# EAGLE design atmega328 (EAGLE 9.6.2)
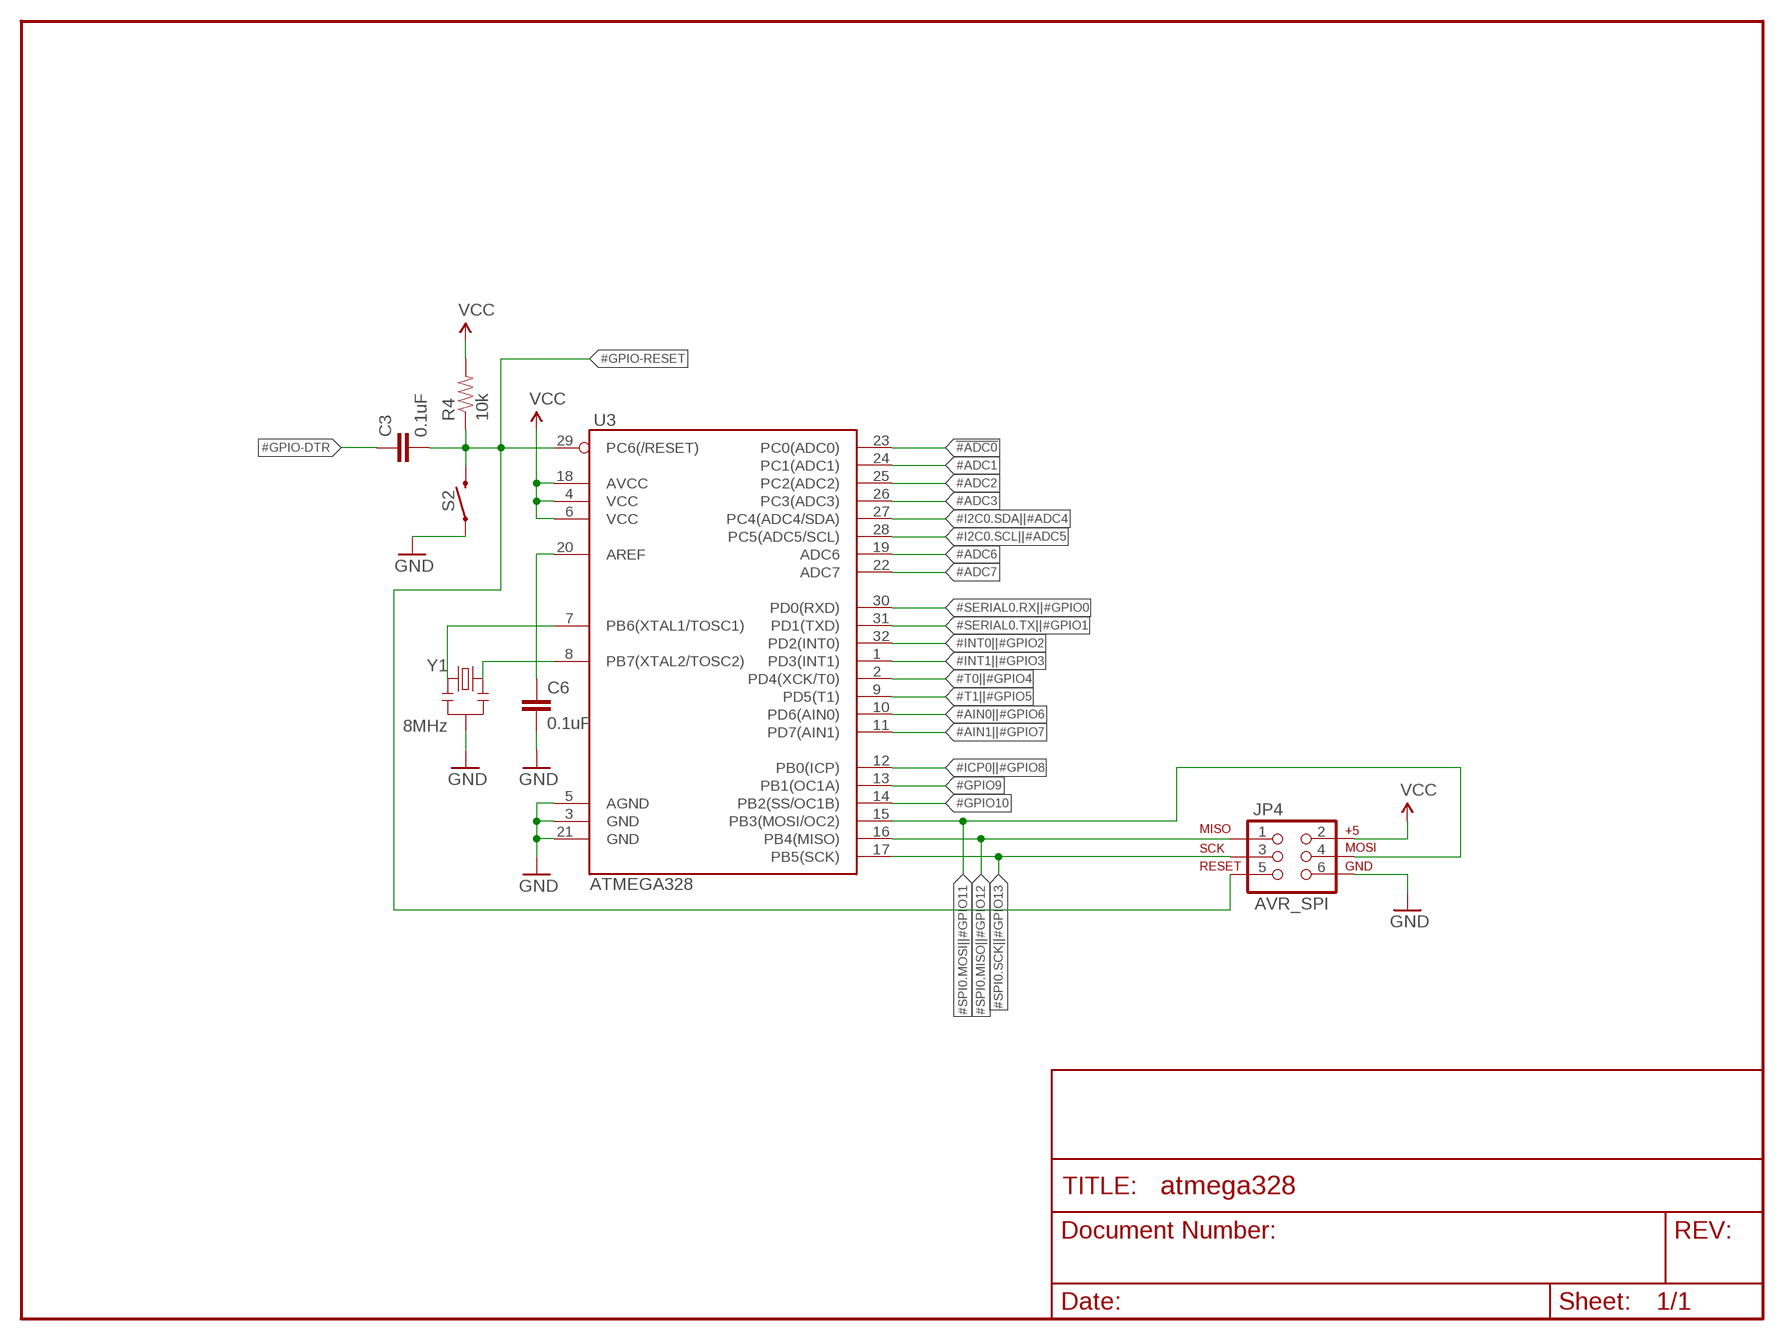
[diagram p0: schematic, sheet 1]

## Parts
C3  0.1uF  0.1UF-0603-25V-5%  [0603]
C6  0.1uF  0.1UF-0603-25V-5%  [0603]
JP4  AVR_SPI  AVR_SPI_PRG_6PTH  [2X3]
R4  10k  10KOHM-0603-1/10W-1%  [0603]
S2  MOMENTARY-SWITCH-SPST-SMD-6.2MM-TALL  [TACTILE_SWITCH_SMD_6.2MM_TALL]
U3  ATMEGA328  ATMEGA168  [TQFP32-08]
Y1  8MHz  RESONATORSMD  [RESONATOR-SMD]

## Nets
!#ADC0: U3.23(PC0(ADC0))
#ADC1: U3.24(PC1(ADC1))
#ADC2: U3.25(PC2(ADC2))
#ADC3: U3.26(PC3(ADC3))
#ADC6: U3.19(ADC6)
#ADC7: U3.22(ADC7)
#AIN0||#GPIO6: U3.10(PD6(AIN0))
#AIN1||#GPIO7: U3.11(PD7(AIN1))
#GPIO9: U3.13(PB1(OC1A))
#GPIO10: U3.14(PB2(SS/OC1B))
#GPIO-DTR: C3.1
#GPIO-RESET: C3.2 JP4.5 R4.1 S2.B2 U3.29(PC6(/RESET))
#I2C0.SCL||#ADC5: U3.28(PC5(ADC5/SCL))
#I2C0.SDA||#ADC4: U3.27(PC4(ADC4/SDA))
#ICP0||#GPIO8: U3.12(PB0(ICP))
#INT0||#GPIO2: U3.32(PD2(INT0))
#INT1||#GPIO3: U3.1(PD3(INT1))
#SERIAL0.RX||#GPIO0: U3.30(PD0(RXD))
#SERIAL0.TX||#GPIO1: U3.31(PD1(TXD))
#SPI0.MISO||#GPIO12: JP4.1 U3.16(PB4(MISO))
#SPI0.MOSI||#GPIO11: JP4.4 U3.15(PB3(MOSI/OC2))
#SPI0.SCK||#GPIO13: JP4.3 U3.17(PB5(SCK))
#T0||#GPIO4: U3.2(PD4(XCK/T0))
#T1||#GPIO5: U3.9(PD5(T1))
AREF: C6.1 U3.20(AREF)
GND: C6.2 JP4.6 S2.A2 U3.3(GND) U3.5(AGND) U3.21(GND) Y1.2
N$10: U3.7(PB6(XTAL1/TOSC1)) Y1.3
N$12: U3.8(PB7(XTAL2/TOSC2)) Y1.1
VCC [VCC]: JP4.2 R4.2 U3.4(VCC) U3.6(VCC) U3.18(AVCC)

## Library data of the parts
C3 C6 = SparkFun-Capacitors:0.1UF: 0.1µF ceramic capacitors A capacitor is a passive two-terminal electrical component used to store electrical energy temporarily in an electric field.; PROD_ID: CAP-08604
JP4 = SparkFun:AVR_SPI_PRG_6: AVR ISP 6 Pin This is the reduced ISP connector for AVR programming. Common on Arduino. This footprint will take up less PCB space and can be used with a 10-pin to 6-pin adapter such as SKU: BOB-08508
R4 = SparkFun-Resistors:10KOHM: 10kΩ resistor A resistor is a passive two-terminal electrical component that implements electrical resistance as a circuit element. Resistors act to reduce current flow, and, at the same time, act to lower voltage levels within circuits. - Wikipedia; PROD_ID: RES-00824
S2 = SparkFun-Switches:MOMENTARY-SWITCH-SPST: Momentary Switch (Pushbutton) - SPST Normally-open (NO) SPST momentary switches (buttons, pushbuttons). Variants PTH-12MM - 12mm square, through-hole Momentary Pushbutton Switch - 12mm Square <https://www.sparkfun.com/products/9190> (COM-09190) PTH-6.0MM, PTH-6.0MM-KIT - 6.0mm square, through-hole Mini Pushbutton Switch <https://www.sparkfun.com/products/97> (COM-00097) KIT package intended for soldering kit's - only one side of pads' copper is exposed. PTH-RIGHT-ANGLE-KIT - Right-angle, through-hole Right Angle Tactile Button <https://www.sparkfun.com/products/10791> - Used on SparkFun BigTime Watch Kit <https://www.sparkfun.com/products/11734> SMD-12MM - 12mm square, surface-mount Tactile Button - SMD (12mm) <https://www.sparkfun.com/products/12993> (COM-12993) Used on SparkFun PicoBoard <https://www.sparkfun.com/products/11888> SMD-4.5MM - 4.5mm Square Trackball Switch Used on SparkFun Blackberry Trackballer Breakout <https://www.sparkfun.com/products/13169> SMD-4.6MMX2.8MM - 4.60mm x 2.80mm, surface mount Used on SparkFun SAMD21 Mini Breakout <https://www.sparkfun.com/products/13664> SMD-5.2MM, SMD-5.2-REDUNDANT - 5.2mm square, surface-mount Mini Pushbutton Switch - SMD <https://www.sparkfun.com/products/8720> (COM-08720) Used on Arduino Pro Mini <https://www.sparkfun.com/products/11114> REDUNDANT package connects both switch circuits together SMD-6.0X3.5MM - 6.0 x 3.5mm, surface mount Momentary Reset Switch SMD <https://www.sparkfun.com/products/8229> (COM-08229) SMD-6.2MM-TALL - 6.2mm square, surface mount Tactile Button - SMD (6mm) <https://www.sparkfun.com/products/12992> Used on SparkFun Digital Sandbox <https://www.sparkfun.com/products/12651> SMD-RIGHT-ANGLE - Right-angle, surface mount Used on SparkFun Block for Intel® Edison - Arduino <https://www.sparkfun.com/products/13036>; PROD_ID: SWCH-11966; SF_SKU: COM-12992
U3 = SparkFun:ATMEGA168
Y1 = SparkFun:RESONATOR: Resonator Small SMD resonator. This is the itty bitty 10/20MHz resonators with built in caps. CSTCE10M0G55 and CSTCE20M0V53. Footprint has been reviewed closely but hasn't been tested yet.

## Net classes
1 VCC: width 0.381 mm

## Board
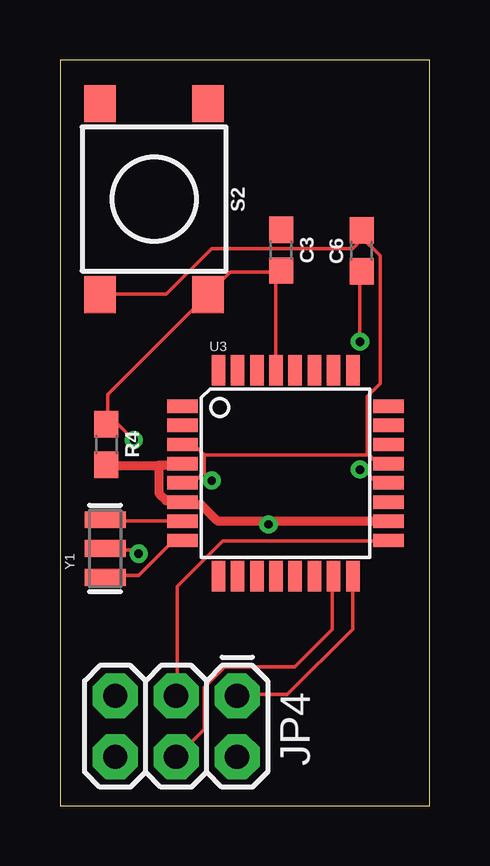
[diagram p1: board, top side]
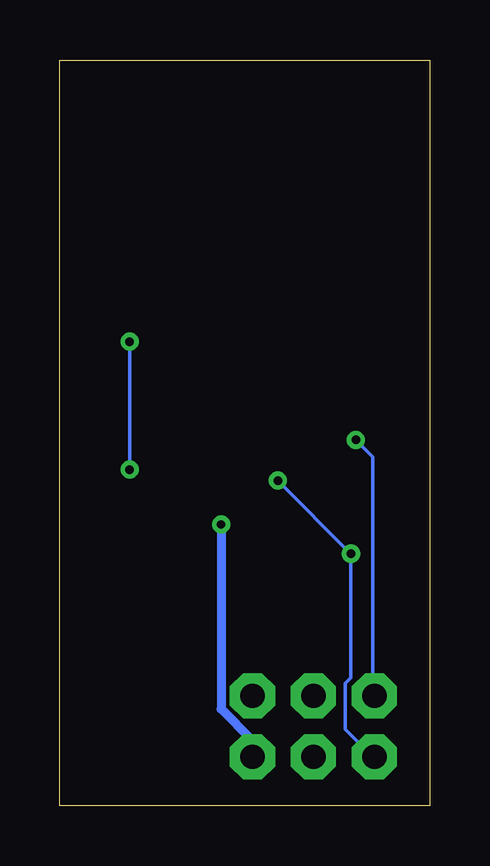
[diagram p2: board, bottom side, seen from below]

Size 15.4 x 31.1 mm. Coordinates in mm from the lower left corner, seen from the top.
Outline: 0,0 15.4,0 15.4,31.1 0,31.1 0,0
Copper layers (1*16): Top 0.035mm / dielectric 1.5mm / Bottom 0.035mm
Design rules "default": minimum track width 6mil, minimum drill 0.35mm, track to track 6mil, track to pad 6mil, pad to pad 6mil, via to via 6mil, smd to smd 6mil, copper to edge 40mil, drill to drill 6mil, minimum pad ring 10mil, minimum via ring 8mil, stop-mask expansion 4mil, vias tented up to drill 0mil, thermal gap 10mil

### Footprints (pad centres in the part's own frame; a part is rotated, then mirrored left to right if it is on the bottom)
0603 = smd 1.1 x 1: 1 -0.85,0; 2 0.85,0
2X3 = drill 1.016 pad 1.88 octagon: 1 0,0; 2 0,2.54; 3 2.54,0; 4 2.54,2.54; 5 5.08,0; 6 5.08,2.54
TACTILE_SWITCH_SMD_6.2MM_TALL = smd 1.55 x 1.3: A1 -3.975,-2.25; A2 3.975,-2.25; B1 -3.975,2.25; B2 3.975,2.25
TQFP32-08 = smd 1.27 x 0.559: 1 -4.293,2.8; 2 -4.293,2; 3 -4.293,1.2; 4 -4.293,0.4; 5 -4.293,-0.4; 6 -4.293,-1.2; 7 -4.293,-2; 8 -4.293,-2.8; 17 4.293,-2.8; 18 4.293,-2; 19 4.293,-1.2; 20 4.293,-0.4; 21 4.293,0.4; 22 4.293,1.2; 23 4.293,2; 24 4.293,2.8 | smd 0.559 x 1.27: 9 -2.8,-4.293; 10 -2,-4.293; 11 -1.2,-4.293; 12 -0.4,-4.293; 13 0.4,-4.293; 14 1.2,-4.293; 15 2,-4.293; 16 2.8,-4.293; 25 2.8,4.293; 26 2,4.293; 27 1.2,4.293; 28 0.4,4.293; 29 -0.4,4.293; 30 -1.2,4.293; 31 -2,4.293; 32 -2.8,4.293
RESONATOR-SMD = smd 0.7 x 1.7: 1 -1.2,0; 2 0,0; 3 1.2,0

### Placement (x,y rotation side)
C3  9.21,23.17 270 top
C6  12.57,23.14 90 top
JP4  7.38,4.59 180 top
R4  1.93,15.07 270 top
S2  3.92,25.3 270 top
U3  9.4,13.87 0 top
Y1  1.88,10.73 90 top

### Tracks (layer width: path | path; a pad name or v marks a point on that pad's centre or on a via)
#GPIO-RESET  (via drill 0.35)
  Top 0.152: 8.99,22.25 7.09,22.25 6.17,21.34 S2.B2 6.1,21.26 1.98,17.14 1.98,15.93 R4.1 2.41,15.92 v3.07,15.26 | 8.99,22.25 9.14,22.25 C3.2 8.99,22.25 | 8.99,22.25 8.99,18.21 U3.29
  Bottom 0.152: v3.07,15.26 2.36,14.55 2.36,4.65 JP4.5
#SPI0.MISO||#GPIO12
  Top 0.152: U3.16 12.19,9.53 12.19,7.37 9.47,4.65 7.39,4.65 JP4.1
#SPI0.MOSI||#GPIO11
  Top 0.152: U3.15 11.35,9.53 11.35,7.37 9.78,5.79 6.86,5.79 6.02,4.95 6.02,3.2 4.88,2.06 JP4.4
#SPI0.SCK||#GPIO13
  Top 0.152: U3.17 13.64,11.05 6.78,11.05 4.88,9.14 4.88,4.65 JP4.3
AREF  (via drill 0.35)
  Top 0.152: v12.5,19.36 12.5,22.25 C6.1 | v12.5,14.02 12.65,14.02 13.18,13.49 13.64,13.49 U3.20
  Bottom 0.152: v12.5,14.02 v12.5,19.36
GND  (via drill 0.35)
  Top 0.152: v3.28,10.52 3.12,10.67 1.91,10.67 Y1.2 | 5.98,13.91 6.02,13.95 6.02,14.63 | 5.98,13.91 5.56,13.49 5.18,13.49 U3.5 | 6.02,14.63 5.64,15.01 5.18,15.01 U3.3 | 12.84,14.67 13.18,14.33 13.64,14.33 U3.21 | 12.84,14.67 12.8,14.71 12.8,17.07 13.34,17.6 13.34,22.94 12.57,23.7 12.57,23.93 C6.2 12.57,23.62 12.19,23.24 6.33,23.24 4.42,21.34 1.68,21.34 S2.A2 | 6.02,14.63 12.8,14.63 12.84,14.67 | 5.98,13.91 v6.33,13.56
  Bottom 0.152: JP4.6 2.36,2.06 3.5,3.2 3.5,5.11 3.28,5.33 v3.28,10.52 v6.33,13.56
N$10
  Top 0.152: U3.7 5.11,11.89 1.91,11.89 Y1.3
N$12
  Top 0.152: U3.8 5.11,11.05 4.72,11.05 3.28,9.6 1.91,9.6 Y1.1
VCC  (via drill 0.35)
  Top 0.381: 4.12,14.17 1.98,14.17 R4.2 | U3.4 5.11,14.25 5.05,14.2 4.12,14.2 4.12,14.17 | 4.12,14.17 4.12,14.1 4.12,13.03 4.42,12.72 5.11,12.72 U3.6 5.26,12.57 5.87,12.57 6.55,11.89 8.69,11.89 | 8.69,11.89 13.64,11.89 U3.18 | v8.69,11.73 8.69,11.89
  Bottom 0.381: v8.69,11.73 8.69,4.04 7.39,2.74 JP4.2